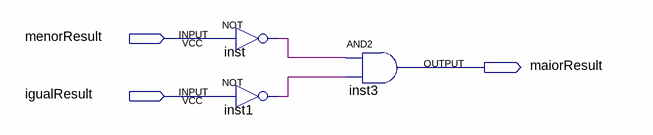
[diagram p0: schematic sheet]
// Quartus schematic Mair.bdf as structural Verilog: 3 symbols, 3 pins
module Mair (
  input  menorResult,
  input  igualResult,
  output maiorResult
);

  wire inst1_out, inst_out;

  not inst (inst_out, menorResult);
  not inst1 (inst1_out, igualResult);
  and inst3 (maiorResult, inst_out, inst1_out);
endmodule
